# Altium schematic sheet Voltage_Regulator.SchDoc
size A3; SheetNumber: 3; SheetTotal: 4
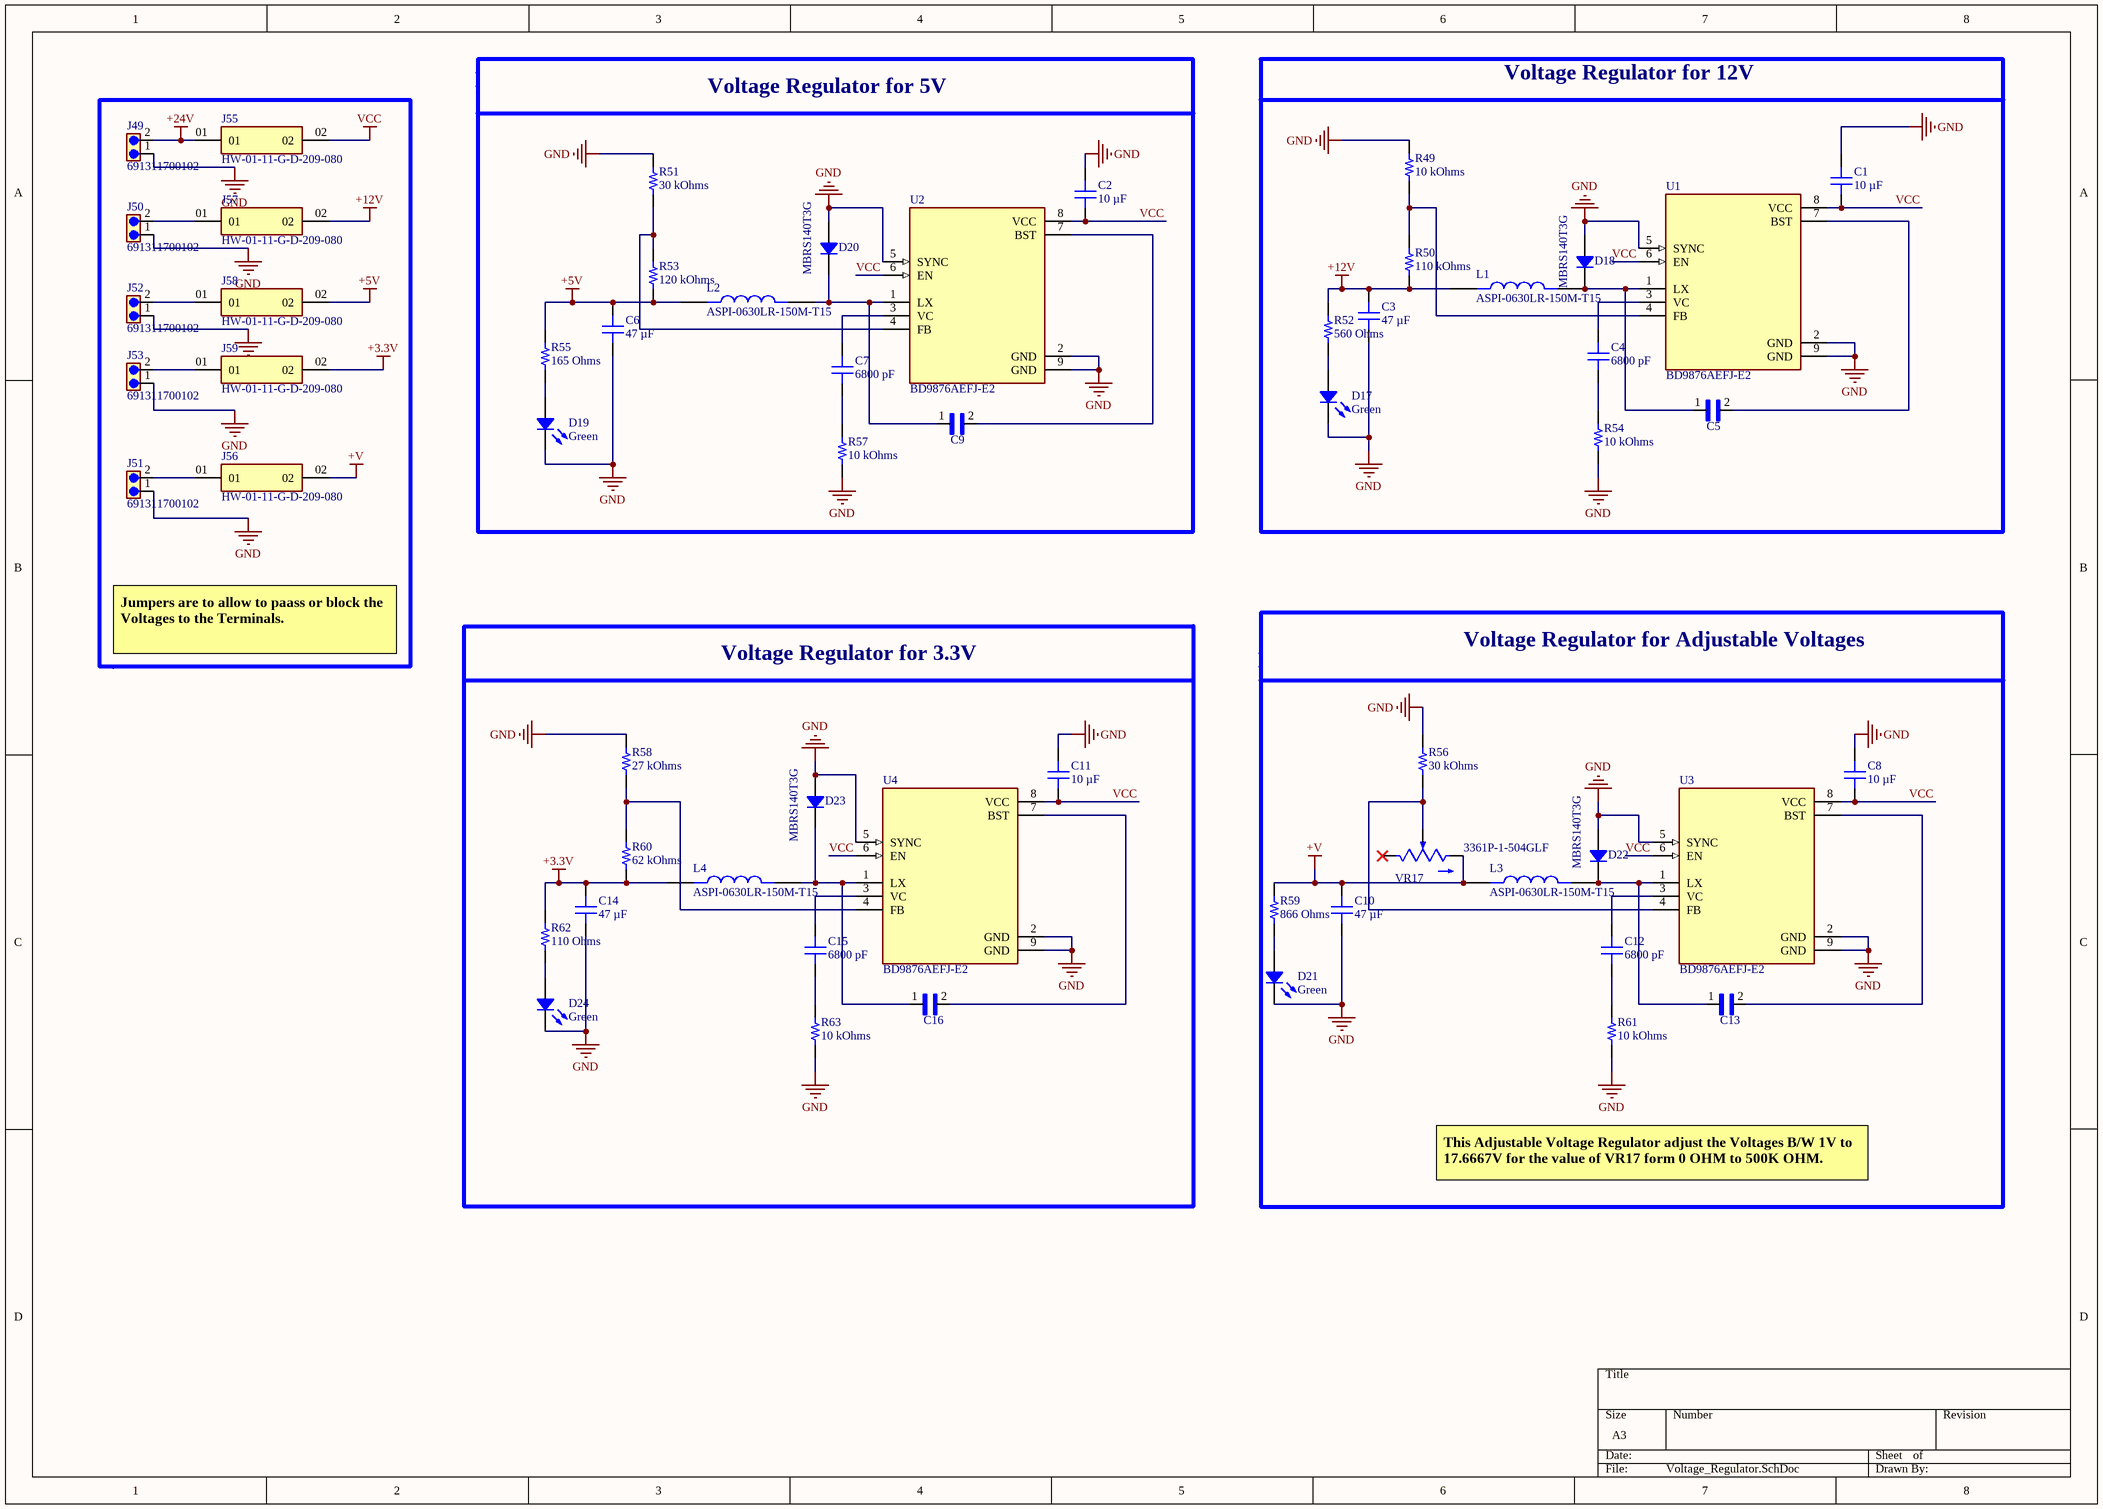
[diagram p0: Voltage_Regulator.SchDoc]

## Parts
C1  10 µF  [CAP 0603_1608]
C2  10 µF  [CAP 0603_1608]
C3  47 µF  [CAP 0603_1608]
C4  6800 pF  [CAP 0603_1608]
C5  C0603C103J5REC7411  [CAPC1608X87N]  (value not drawn)
C6  47 µF  [CAP 0603_1608]
C7  6800 pF  [CAP 0603_1608]
C8  10 µF  [CAP 0603_1608]
C9  C0603C103J5REC7411  [CAPC1608X87N]  (value not drawn)
C10  47 µF  [CAP 0603_1608]
C11  10 µF  [CAP 0603_1608]
C12  6800 pF  [CAP 0603_1608]
C13  C0603C103J5REC7411  [CAPC1608X87N]  (value not drawn)
C14  47 µF  [CAP 0603_1608]
C15  6800 pF  [CAP 0603_1608]
C16  C0603C103J5REC7411  [CAPC1608X87N]  (value not drawn)
D17  Green  [LED 0805_2012 GREEN]
D18  MBRS140T3G  [DO214AA SMB]
D19  Green  [LED 0805_2012 GREEN]
D20  MBRS140T3G  [DO214AA SMB]
D21  Green  [LED 0805_2012 GREEN]
D22  MBRS140T3G  [DO214AA SMB]
D23  MBRS140T3G  [DO214AA SMB]
D24  Green  [LED 0805_2012 GREEN]
J49  691311700102  [691311700102]
J50  691311700102  [691311700102]
J51  691311700102  [691311700102]
J52  691311700102  [691311700102]
J53  691311700102  [691311700102]
J55  HW-01-11-G-D-209-080  [SAMTEC_HW-01-11-G-D-209-080]
J56  HW-01-11-G-D-209-080  [SAMTEC_HW-01-11-G-D-209-080]
J57  HW-01-11-G-D-209-080  [SAMTEC_HW-01-11-G-D-209-080]
J58  HW-01-11-G-D-209-080  [SAMTEC_HW-01-11-G-D-209-080]
J59  HW-01-11-G-D-209-080  [SAMTEC_HW-01-11-G-D-209-080]
L1  ASPI-0630LR-150M-T15  [IND_ASPI-0630LR-150M-T15]
L2  ASPI-0630LR-150M-T15  [IND_ASPI-0630LR-150M-T15]
L3  ASPI-0630LR-150M-T15  [IND_ASPI-0630LR-150M-T15]
L4  ASPI-0630LR-150M-T15  [IND_ASPI-0630LR-150M-T15]
R49  10 kOhms  [RES 0603_1608]
R50  110 kOhms  [RES 0603_1608]
R51  30 kOhms  [RES 0603_1608]
R52  560 Ohms  [RES 0603_1608]
R53  120 kOhms  [RES 0603_1608]
R54  10 kOhms  [RES 0603_1608]
R55  165 Ohms  [RES 0603_1608]
R56  30 kOhms  [RES 0603_1608]
R57  10 kOhms  [RES 0603_1608]
R58  27 kOhms  [RES 0603_1608]
R59  866 Ohms  [RES 0603_1608]
R60  62 kOhms  [RES 0603_1608]
R61  10 kOhms  [RES 0603_1608]
R62  110 Ohms  [RES 0603_1608]
R63  10 kOhms  [RES 0603_1608]
U1  BD9876AEFJ-E2  [SOIC127P600X100-9N]
U2  BD9876AEFJ-E2  [SOIC127P600X100-9N]
U3  BD9876AEFJ-E2  [SOIC127P600X100-9N]
U4  BD9876AEFJ-E2  [SOIC127P600X100-9N]
VR17  3361P-1-504GLF  [TRIM_3361P-1-504GLF]

## Blocks framed on the sheet
Voltage Regulator for 12V: C1 C3-C5 D17 D18 L1 R49 R50 R52 R54 U1
Voltage Regulator for 3.3V: C11 C14-C16 D23 D24 L4 R58 R60 R62 R63 U4

## Nets
+3.3V: C14.2 J59.02 L4.1 R60.2 R62.2
+5V: C6.2 J58.02 L2.1 R53.1 R55.2
+12V: C3.2 J57.02 L1.1 R50.1 R52.2
+24V: J49.2 J55.01
+V: C10.2 J56.02 L3.1 R59.2 VR17.3(CW)
GND: C1.2 C2.2 C3.1 C6.1 C8.2 C10.1 C11.2 C14.1 D17.2 D18.1 D19.2 D20.1 D21.2 D22.1 D23.1 D24.2 J49.1 J50.1 J51.1 J52.1 J53.1 R49.2 R51.2 R54.1 R56.2 R57.1 R58.2 R61.1 R63.1 U1.2(GND) U1.5(SYNC) U1.9(GND) U2.2(GND) U2.5(SYNC) U2.9(GND) U3.2(GND) U3.5(SYNC) U3.9(GND) U4.2(GND) U4.5(SYNC) U4.9(GND)
VCC: C1.1 C2.1 C8.1 C11.1 J55.02 U1.6(EN) U1.8(VCC) U2.6(EN) U2.8(VCC) U3.6(EN) U3.8(VCC) U4.6(EN) U4.8(VCC)
NetC4_1: C4.1 R54.2
NetC4_2: C4.2 U1.3(VC)
NetC5_1: C5.1 D18.2 L1.2 U1.1(LX)
NetC5_2: C5.2 U1.7(BST)
NetC7_1: C7.1 R57.2
NetC7_2: C7.2 U2.3(VC)
NetC9_1: C9.1 D20.2 L2.2 U2.1(LX)
NetC9_2: C9.2 U2.7(BST)
NetC12_1: C12.1 R61.2
NetC12_2: C12.2 U3.3(VC)
NetC13_1: C13.1 D22.2 L3.2 U3.1(LX)
NetC13_2: C13.2 U3.7(BST)
NetC15_1: C15.1 R63.2
NetC15_2: C15.2 U4.3(VC)
NetC16_1: C16.1 D23.2 L4.2 U4.1(LX)
NetC16_2: C16.2 U4.7(BST)
NetD17_1: D17.1 R52.1
NetD19_1: D19.1 R55.1
NetD21_1: D21.1 R59.1
NetD24_1: D24.1 R62.1
NetJ50_2: J50.2 J57.01
NetJ51_2: J51.2 J56.01
NetJ52_2: J52.2 J58.01
NetJ53_2: J53.2 J59.01
NetR49_1: R49.1 R50.2 U1.4(FB)
NetR51_1: R51.1 R53.2 U2.4(FB)
NetR56_1: R56.1 U3.4(FB) VR17.2(WIPER)
NetR58_1: R58.1 R60.1 U4.4(FB)

Not connected (* = marked no-connect by the designer): VR17 1(CCW)*

## Notes on the sheet
- Voltage Regulator for 5V
- Jumpers are to allow to paass or block the Voltages to the Terminals.
- Voltage Regulator for Adjustable Voltages
- This Adjustable Voltage Regulator adjust the Voltages B/W 1V to 17.6667V for the value of VR17 form 0 OHM to 500K OHM.

## Library data of the parts
C1 C2 C8 C11 = 0603DD106MAT2A: CAP CER 10UF 35V X5R 0603; manufacturer: KYOCERA AVX; Tolerance: ±20%; Part Number: 0603DD106MAT2A; Value: 10 µF; Applications: General Purpose; Capacitance: 10 µF; componentlink2description: DigiKey Link; componentlink2url: https://www.digikey.com/en/products/detail/kyocera-avx/0603DD106MAT2A/16602926; Device Package: 0603 (1608 Metric); lastupdated: 08/03/2023 8:07:23 pm; Lifecycle Status: Active; Minimum Order: 1; Mounting Type: Surface Mount, MLCC; Operating Temperature: -55°C ~ 85°C; Package / Case: 0603 (1608 Metric); packaging: TapeAndReel; partid: 46895; Part Status: Active; price: 0.05; series: -; Size / Dimension: 0.063" L x 0.031" W (1.60mm x 0.80mm); Supplier 1: DigiKey; Supplier Part Number 1: 478-0603DD106MAT2ACT-ND; Temperature Coefficient: X5R; Voltage - Rated: 35V
C3 C6 C10 C14 = GRM188R60J476ME15D: CAP CER 47UF 6.3V X5R 0603; manufacturer: Murata Electronics; Tolerance: ±20%; Part Number: GRM188R60J476ME15D; Value: 47 µF; Applications: General Purpose; Capacitance: 47 µF; componentlink1description: Datasheet; componentlink1url: https://www.murata.com/~/media/webrenewal/support/library/catalog/products/capacitor/mlcc/c02e.ashx?la=en-us; componentlink2description: DigiKey Link; componentlink2url: https://www.digikey.com/en/products/detail/murata-electronics/GRM188R60J476ME15D/5877410; Device Package: 0603 (1608 Metric); lastupdated: 08/03/2023 8:08:50 pm; Lifecycle Status: Active; Minimum Order: 1; Mounting Type: Surface Mount, MLCC; Operating Temperature: -55°C ~ 85°C; Package / Case: 0603 (1608 Metric); packaging: TapeAndReel; partid: 5468; Part Status: Active; price: 0.10; series: GRM; Size / Dimension: 0.063" L x 0.031" W (1.60mm x 0.80mm); Supplier 1: DigiKey; Supplier Part Number 1: 490-13247-1-ND; Temperature Coefficient: X5R; Thickness (Max): 0.039" (1.00mm); Voltage - Rated: 6.3V
C4 C7 C12 C15 = EMK107SD682JA-T: CAP CER 6800PF 16V 0603; manufacturer: Taiyo Yuden; Tolerance: ±5%; Part Number: EMK107SD682JA-T; Value: 6800 pF; Applications: General Purpose; Capacitance: 6800 pF; componentlink1description: Datasheet; componentlink1url: http://www.yuden.co.jp/productdata/catalog/mlcc07_e.pdf; componentlink2description: DigiKey Link; componentlink2url: https://www.digikey.com/en/products/detail/taiyo-yuden/EMK107SD682JA-T/930441; Device Package: 0603 (1608 Metric); Features: Low Distortion; lastupdated: 08/03/2023 8:08:44 pm; Lifecycle Status: Active; Minimum Order: 1; Mounting Type: Surface Mount, MLCC; Operating Temperature: -55°C ~ 125°C; Package / Case: 0603 (1608 Metric); packaging: TapeAndReel; partid: 7463; Part Status: Active; price: 0.07; series: CFCAP™; Size / Dimension: 0.063" L x 0.031" W (1.60mm x 0.80mm); Supplier 1: DigiKey; Supplier Part Number 1: 587-1089-1-ND; Thickness (Max): 0.035" (0.90mm); Voltage - Rated: 16V
C5 C9 C13 C16 = C0603C103J5REC7411: 10000pF Â±5% 50V Ceramic Capacitor X7R 0603 (1608 Metric); MF: KEMET; DigiKey-Purchase-URL: https://snapeda.com/shop?store=DigiKey&id=2066766; MP: C0603C103J5REC7411; Availability: Unavailable; Package: 1608 KEMET; Value: *; Price: None; SnapEDA_Link: https://www.snapeda.com/parts/C0603C103J5REC7411/KEMET/view-part/2066766/?ref=snap
D17 D19 D21 D24 = QTLP630C4TR: LED GREEN CLEAR 0805 SMD; Manufacturer: Everlight Electronics Co Ltd; Configuration: Standard; Current - Test: 20mA; Lens Color: Colorless; Lens Size: 1.40mm x 1.25mm; Lens Style: Rectangle with Flat Top; Millicandela Rating: 10mcd; Viewing Angle: 140°; Voltage - Forward (Vf) (Typ): 2.1V; Wavelength - Dominant: 570nm; Wavelength - Peak: 565nm; Part Number: QTLP630C4TR; Color: Green; ComponentLink1Description: Datasheet; ComponentLink1URL: //media.digikey.com/PDF/Data%20Sheets/Everlight%20PDFs/QTLP630-2.pdf; ComponentLink2Description: DigiKey Link; ComponentLink2URL: https://www.digikey.com/en/products/detail/everlight-electronics-co-ltd/QTLP630C4TR/2675902; Device Package: 0805 (2012 Metric); Height (Max): 1.20mm; LastUpdated: 08/03/2023 8:58:32 pm; Lens Transparency: Clear; Lifecycle Status: Active; Minimum Order: 1; Mounting Type: Surface Mount; Package / Case: 0805 (2012 Metric); Packaging: TapeAndReel; PartId: 240; Part Status: Active; Price: 0.04; Series: -; Size / Dimension: 2.00mm L x 1.25mm W; Supplier 1: DigiKey; Supplier Part Number 1: 1080-1411-1-ND; Supplier Device Package: 0805; Value: Green
D18 D20 D22 D23 = MBRS140T3G: DIODE SCHOTTKY 40V 1A SMB; Manufacturer: ON Semiconductor; Current - Reverse Leakage @ Vr: 1mA @ 40V; Speed: Fast Recovery =< 500ns, > 200mA (Io); Voltage - Forward (Vf) (Max) @ If: 600mV @ 1A; Part Number: MBRS140T3G; ComponentLink1Description: Datasheet; ComponentLink1URL: https://www.onsemi.com/pub/Collateral/MBRS140T3-D.PDF; ComponentLink2Description: DigiKey Link; ComponentLink2URL: http://digikey.com/product-detail/en/on-semiconductor/MBRS140T3G/MBRS140T3GOSCT-ND/918002; Current - Average Rectified (Io): 1A; Diode Type: Schottky; LastUpdated: 08/03/2023 8:53:35 pm; Lifecycle Status: Active; Minimum Order: 1; Mounting Type: Surface Mount; Operating Temperature - Junction: -65°C ~ 125°C; Package / Case: DO-214AA, SMB; Packaging: TapeAndReel; PartId: 1387; Part Status: Active; Price: 0.08; Series: -; Supplier 1: DigiKey; Supplier Part Number 1: MBRS140T3GOSCT-ND; Supplier Device Package: SMB; Voltage - DC Reverse (Vr) (Max): 40V
J49-J53 = 691311700102: 2 Position Terminal Block Header, Male Pins, Shrouded (4 Side) 0.197 (5.00mm) Vertical - Through Hole; MF: WÃ¼rth Elektronik; Value: *; Check_prices: https://www.snapeda.com/parts/691311700102/Wurth+Elektronik/view-part/?ref=eda; Availability: In Stock; Package: None; SnapEDA_Link: https://www.snapeda.com/parts/691311700102/Wurth+Elektronik/view-part/?ref=snap; Purchase-URL: https://pricing.snapeda.com/search/part/691311700102/?ref=eda; Price: None; MP: 691311700102
J55-J59 = HW-01-11-G-D-209-080: CONN HDR 2POS STACK T/H; MF: Samtec; Purchase-URL: https://pricing.snapeda.com/search/part/HW-01-11-G-D-209-080/?ref=eda; Value: *; Package: None; Check_prices: https://www.snapeda.com/parts/HW-01-11-G-D-209-080/Samtec/view-part/?ref=eda; Price: None; MP: HW-01-11-G-D-209-080; Availability: In Stock; SnapEDA_Link: https://www.snapeda.com/parts/HW-01-11-G-D-209-080/Samtec/view-part/?ref=snap
L1-L4 = ASPI-0630LR-150M-T15: 15 ÂµH Shielded Molded Inductor 3 A 120mOhm Max Nonstandard; MF: Abracon LLC; Check_prices: https://www.snapeda.com/parts/ASPI-0630LR-150M-T15/Abracon+LLC/view-part/?ref=eda; Digi-Key_Part_Number: ASPI-0630LR-150M-T15TR-ND; Value: *; SnapEDA_Link: https://www.snapeda.com/parts/ASPI-0630LR-150M-T15/Abracon+LLC/view-part/?ref=snap; Package: Nonstandard Abracon LLC; MP: ASPI-0630LR-150M-T15; Purchase-URL: https://pricing.snapeda.com/search/part/ASPI-0630LR-150M-T15/?ref=eda
R49 = RT0603FRE0710KL: RES SMD 10K OHM 1% 1/10W 0603; Manufacturer: Yageo; Power (Watts): 0.1W, 1/10W; Temperature Coefficient: ±50ppm/°C; Part Number: RT0603FRE0710KL; Value: 10 kOhms; ComponentLink1Description: Datasheet; ComponentLink1URL: https://www.yageo.com/upload/media/product/productsearch/datasheet/rchip/PYu-RT_1-to-0.01_RoHS_L_11.pdf; ComponentLink2Description: DigiKey Link; ComponentLink2URL: https://www.digikey.com/en/products/detail/yageo/RT0603FRE0710KL/1075040; Composition: Thin Film; Device Package: 0603 (1608 Metric); Height - Seated (Max): 0.022" (0.55mm); LastUpdated: 08/03/2023 8:30:15 pm; Lifecycle Status: Active; Minimum Order: 1; Number of Terminations: 2; Operating Temperature: -55°C ~ 155°C; Package / Case: 0603 (1608 Metric); Packaging: TapeAndReel; PartId: 5671; Part Status: Active; Price: 0.01; Resistance: 10 kOhms; Series: RT; Size / Dimension: 0.063" L x 0.031" W (1.60mm x 0.80mm); Supplier 1: DigiKey; Supplier Part Number 1: YAG2321CT-ND; Supplier Device Package: 0603; Tolerance: ±1%
R50 = CRCW0603110KFKEA: RES SMD 110K OHM 1% 1/10W 0603; Manufacturer: Vishay Dale; Power (Watts): 0.1W, 1/10W; Temperature Coefficient: ±100ppm/°C; Part Number: CRCW0603110KFKEA; Value: 110 kOhms; ComponentLink1Description: Datasheet; ComponentLink1URL: http://www.vishay.com/docs/20035/dcrcwe3.pdf; ComponentLink2Description: DigiKey Link; ComponentLink2URL: http://digikey.com/product-detail/en/vishay-dale/CRCW0603110KFKEA/541-110KHCT-ND/1180042; Composition: Thick Film; Device Package: 0603 (1608 Metric); Features: Automotive AEC-Q200; Height - Seated (Max): 0.020" (0.50mm); LastUpdated: 08/03/2023 8:30:07 pm; Lifecycle Status: Active; Minimum Order: 1; Number of Terminations: 2; Operating Temperature: -55°C ~ 155°C; Package / Case: 0603 (1608 Metric); Packaging: CutTape; PartId: 7799; Part Status: Active; Price: 0.10; Ratings: AEC-Q200; Resistance: 110 kOhms; Series: CRCW; Size / Dimension: 0.061" L x 0.033" W (1.55mm x 0.85mm); Supplier 1: DigiKey; Supplier Part Number 1: 541-110KHCT-ND; Supplier Device Package: 0603; Tolerance: ±1%
R51 R56 = RMCF0603FT30K0: RES 30K OHM 1% 1/10W 0603; Manufacturer: Stackpole Electronics Inc; Power (Watts): 0.1W, 1/10W; Temperature Coefficient: ±100ppm/°C; Part Number: RMCF0603FT30K0; Value: 30 kOhms; ComponentLink1Description: Datasheet; ComponentLink1URL: https://www.seielect.com/catalog/sei-rmcf_rmcp.pdf; ComponentLink2Description: DigiKey Link; ComponentLink2URL: https://www.digikey.com/en/products/detail/stackpole-electronics-inc/RMCF0603FT30K0/1760793; Composition: Thick Film; Device Package: 0603 (1608 Metric); Features: Automotive AEC-Q200; Height - Seated (Max): 0.022" (0.55mm); LastUpdated: 08/03/2023 8:29:57 pm; Lifecycle Status: Active; Minimum Order: 1; Number of Terminations: 2; Operating Temperature: -55°C ~ 155°C; Package / Case: 0603 (1608 Metric); Packaging: CutTape; PartId: 10655; Part Status: Active; Price: 0.01; Ratings: AEC-Q200; Resistance: 30 kOhms; Series: RMCF; Size / Dimension: 0.061" L x 0.031" W (1.55mm x 0.80mm); Supplier 1: DigiKey; Supplier Part Number 1: RMCF0603FT30K0CT-ND; Supplier Device Package: 0603; Tolerance: ±1%
R52 = MCT06030C5600FP500: RES SMD 560 OHM 1% 1/8W 0603; Manufacturer: Vishay Beyschlag; Power (Watts): 0.125W, 1/8W; Temperature Coefficient: ±50ppm/°C; Part Number: MCT06030C5600FP500; Value: 560 Ohms; ComponentLink1Description: Datasheet; ComponentLink1URL: http://www.vishay.com/docs/28705/mcx0x0xpro.pdf; ComponentLink2Description: DigiKey Link; ComponentLink2URL: http://digikey.com/product-detail/en/vishay-beyschlag/MCT06030C5600FP500/MCT0603-560-CFCT-ND/2607914; Composition: Thin Film; Device Package: 0603 (1608 Metric); Features: Anti-Sulfur; Height - Seated (Max): 0.022" (0.55mm); LastUpdated: 14/03/2023 7:28:48 pm; Lifecycle Status: Active; Minimum Order: 1; Number of Terminations: 2; Operating Temperature: -55°C ~ 155°C; Package / Case: 0603 (1608 Metric); Packaging: TapeAndReel; PartId: 14498; Part Status: Active; Price: 0.02; Resistance: 560 Ohms; Series: MCT - Professional; Size / Dimension: 0.061" L x 0.033" W (1.55mm x 0.85mm); Supplier 1: DigiKey; Supplier Part Number 1: MCT0603-560-CFCT-ND; Supplier Device Package: 0603; Tolerance: ±1%
R53 = CRGP0603F120K: RES 120K OHM 1% 1/4W 0603; Manufacturer: TE Connectivity Passive Product; Power (Watts): 0.25W, 1/4W; Temperature Coefficient: ±100ppm/°C; Part Number: CRGP0603F120K; Value: 120 kOhms; ComponentLink1Description: Datasheet; ComponentLink1URL: https://www.te.com/commerce/DocumentDelivery/DDEController?Action=srchrtrv&DocNm=9-1773463-9&DocType=DS&DocLang=English; ComponentLink2Description: DigiKey Link; ComponentLink2URL: https://www.digikey.com/en/products/detail/te-connectivity-passive-product/CRGP0603F120K/8577043; Composition: Thick Film; Device Package: 0603 (1608 Metric); Features: Pulse Withstanding; Height - Seated (Max): 0.022" (0.55mm); LastUpdated: 08/03/2023 8:30:17 pm; Lifecycle Status: Active; Minimum Order: 1; Number of Terminations: 2; Operating Temperature: -55°C ~ 155°C; Package / Case: 0603 (1608 Metric); Packaging: TapeAndReel; PartId: 5040; Part Status: Active; Price: 0.02; Resistance: 120 kOhms; Series: CRGP; Size / Dimension: 0.063" L x 0.031" W (1.60mm x 0.80mm); Supplier 1: DigiKey; Supplier Part Number 1: A130441CT-ND; Supplier Device Package: 0603; Tolerance: ±1%
R54 R57 R61 R63 = RNCS0603BKE10K0: RES 10K OHM 0.1% 1/16W 0603; Manufacturer: Stackpole Electronics Inc; Power (Watts): 0.063W, 1/16W; Temperature Coefficient: ±25ppm/°C; Part Number: RNCS0603BKE10K0; Value: 10 kOhms; ComponentLink1Description: Datasheet; ComponentLink1URL: https://www.seielect.com/catalog/sei-rncs_rnch.pdf; ComponentLink2Description: DigiKey Link; ComponentLink2URL: https://www.digikey.com/en/products/detail/stackpole-electronics-inc/RNCS0603BKE10K0/1708836; Composition: Thin Film; Device Package: 0603 (1608 Metric); Features: Anti-Corrosive, Automotive AEC-Q200, Moisture Resistant; Height - Seated (Max): 0.022" (0.55mm); LastUpdated: 08/03/2023 8:30:18 pm; Lifecycle Status: Active; Minimum Order: 1; Number of Terminations: 2; Operating Temperature: -55°C ~ 155°C; Package / Case: 0603 (1608 Metric); Packaging: TapeAndReel; PartId: 4838; Part Status: Active; Price: 0.07; Ratings: AEC-Q200; Resistance: 10 kOhms; Series: RNCS; Size / Dimension: 0.061" L x 0.031" W (1.55mm x 0.80mm); Supplier 1: DigiKey; Supplier Part Number 1: RNCS0603BKE10K0CT-ND; Supplier Device Package: 0603; Tolerance: ±0.1%
R55 = RK73H1JTTD1650F: RES 165 OHM 1% 1/8W 0603; Manufacturer: KOA Speer Electronics, Inc.; Power (Watts): 0.125W, 1/8W; Temperature Coefficient: ±100ppm/°C; Part Number: RK73H1JTTD1650F; Value: 165 Ohms; ComponentLink1Description: Datasheet; ComponentLink1URL: http://www.koaspeer.com/catimages/Products/RK73H/RK73H.pdf; ComponentLink2Description: DigiKey Link; ComponentLink2URL: https://www.digikey.com/en/products/detail/koa-speer-electronics-inc/RK73H1JTTD1650F/9845302; Composition: Thick Film; Device Package: 0603 (1608 Metric); Features: Automotive AEC-Q200, Moisture Resistant; Height - Seated (Max): 0.022" (0.55mm); LastUpdated: 14/03/2023 7:29:07 pm; Lifecycle Status: Active; Minimum Order: 1; Number of Terminations: 2; Operating Temperature: -55°C ~ 155°C; Package / Case: 0603 (1608 Metric); Packaging: CutTape; PartId: 8816; Part Status: Active; Price: 0.01; Ratings: AEC-Q200; Resistance: 165 Ohms; Series: RK73H; Size / Dimension: 0.063" L x 0.031" W (1.60mm x 0.80mm); Supplier 1: DigiKey; Supplier Part Number 1: 2019-RK73H1JTTD1650FCT-ND; Supplier Device Package: 0603; Tolerance: ±1%
R58 = CRGP0603F27K: RES 27K OHM 1% 1/4W 0603; Manufacturer: TE Connectivity Passive Product; Power (Watts): 0.25W, 1/4W; Temperature Coefficient: ±100ppm/°C; Part Number: CRGP0603F27K; Value: 27 kOhms; ComponentLink1Description: Datasheet; ComponentLink1URL: https://www.te.com/commerce/DocumentDelivery/DDEController?Action=srchrtrv&DocNm=9-1773463-9&DocType=DS&DocLang=English; ComponentLink2Description: DigiKey Link; ComponentLink2URL: https://www.digikey.com/en/products/detail/te-connectivity-passive-product/CRGP0603F27K/8577035; Composition: Thick Film; Device Package: 0603 (1608 Metric); Features: Pulse Withstanding; Height - Seated (Max): 0.022" (0.55mm); LastUpdated: 08/03/2023 8:30:17 pm; Lifecycle Status: Active; Minimum Order: 1; Number of Terminations: 2; Operating Temperature: -55°C ~ 155°C; Package / Case: 0603 (1608 Metric); Packaging: TapeAndReel; PartId: 5007; Part Status: Active; Price: 0.02; Resistance: 27 kOhms; Series: CRGP; Size / Dimension: 0.063" L x 0.031" W (1.60mm x 0.80mm); Supplier 1: DigiKey; Supplier Part Number 1: A130433CT-ND; Supplier Device Package: 0603; Tolerance: ±1%
R59 = RQ73C1J866RBTD: RES 866 OHMS 0.1% 0.15W 0603; Manufacturer: TE Connectivity Passive Product; Temperature Coefficient: ±10ppm/°C; Part Number: RQ73C1J866RBTD; Value: 866 Ohms; ComponentLink1Description: Datasheet; ComponentLink1URL: //media.digikey.com/pdf/Data%20Sheets/Tyco%20Electronics%20P%20B%20PDFs/RQ73-0618%20v2.pdf; ComponentLink2Description: DigiKey Link; ComponentLink2URL: https://www.digikey.com/en/products/detail/te-connectivity-passive-product/RQ73C1J866RBTD/9479913; Composition: Thin Film; Device Package: 0603 (1608 Metric); Features: Anti-Sulfur, Automotive AEC-Q200; Height - Seated (Max): 0.024" (0.60mm); LastUpdated: 14/03/2023 7:29:08 pm; Lifecycle Status: Active; Minimum Order: 1; Number of Terminations: 2; Operating Temperature: -55°C ~ 155°C; Package / Case: 0603 (1608 Metric); Packaging: TapeAndReel; PartId: 8503; Part Status: Active; Power (Watts): 0.15W; Price: 0.26; Ratings: AEC-Q200; Resistance: 866 Ohms; Series: RQ73; Size / Dimension: 0.061" L x 0.031" W (1.55mm x 0.80mm); Supplier 1: DigiKey; Supplier Part Number 1: A139965CT-ND; Supplier Device Package: 0603; Tolerance: ±0.1%
R60 = RMCF0603FT62K0: RES 62K OHM 1% 1/10W 0603; Manufacturer: Stackpole Electronics Inc; Power (Watts): 0.1W, 1/10W; Temperature Coefficient: ±100ppm/°C; Part Number: RMCF0603FT62K0; Value: 62 kOhms; ComponentLink1Description: Datasheet; ComponentLink1URL: https://www.seielect.com/catalog/sei-rmcf_rmcp.pdf; ComponentLink2Description: DigiKey Link; ComponentLink2URL: https://www.digikey.com/en/products/detail/stackpole-electronics-inc/RMCF0603FT62K0/1714175; Composition: Thick Film; Device Package: 0603 (1608 Metric); Features: Automotive AEC-Q200; Height - Seated (Max): 0.022" (0.55mm); LastUpdated: 08/03/2023 8:29:57 pm; Lifecycle Status: Active; Minimum Order: 1; Number of Terminations: 2; Operating Temperature: -55°C ~ 155°C; Package / Case: 0603 (1608 Metric); Packaging: CutTape; PartId: 10723; Part Status: Active; Price: 0.01; Ratings: AEC-Q200; Resistance: 62 kOhms; Series: RMCF; Size / Dimension: 0.061" L x 0.031" W (1.55mm x 0.80mm); Supplier 1: DigiKey; Supplier Part Number 1: RMCF0603FT62K0CT-ND; Supplier Device Package: 0603; Tolerance: ±1%
R62 = MCT06030C1100FP500: RES 110 OHM 1% 1/8W 0603; Manufacturer: Vishay Beyschlag; Power (Watts): 0.125W, 1/8W; Temperature Coefficient: ±50ppm/°C; Part Number: MCT06030C1100FP500; Value: 110 Ohms; ComponentLink1Description: Datasheet; ComponentLink1URL: http://www.vishay.com/docs/28705/mcx0x0xpro.pdf; ComponentLink2Description: DigiKey Link; ComponentLink2URL: http://digikey.com/product-detail/en/vishay-beyschlag/MCT06030C1100FP500/749-MCT06030C1100FP500CT-ND/10453856; Composition: Thin Film; Device Package: 0603 (1608 Metric); Features: Anti-Sulfur; Height - Seated (Max): 0.022" (0.55mm); LastUpdated: 14/03/2023 7:29:21 pm; Lifecycle Status: Active; Minimum Order: 1; Number of Terminations: 2; Operating Temperature: -55°C ~ 155°C; Package / Case: 0603 (1608 Metric); Packaging: TapeAndReel; PartId: 5092; Part Status: Active; Price: 0.02; Resistance: 110 Ohms; Series: MCT - Professional; Size / Dimension: 0.061" L x 0.033" W (1.55mm x 0.85mm); Supplier 1: DigiKey; Supplier Part Number 1: 749-MCT06030C1100FP500CT-ND; Supplier Device Package: 0603; Tolerance: ±1%
U1-U4 = BD9876AEFJ-E2: Buck Switching Regulator IC Positive Adjustable 1V 1 Output 3A 8-SOIC (0.154, 3.90mm Width) Exposed Pad; MF: Rohm; Availability: Bad; Package: SOIC-8 Rohm; Price: None; SnapEDA_Link: https://www.snapeda.com/parts/BD9876AEFJ-E2/Rohm/view-part/78992/?ref=snap; Value: *; MP: BD9876AEFJ-E2
VR17 = 3361P-1-504GLF: 500 kOhms 0.5W, 1/2W Gull Wing Surface Mount Trimmer Potentiometer Cermet 1.0 Turn Top Adjustment; MF: Bourns; Check_prices: https://www.snapeda.com/parts/3361P-1-504GLF/Bourns/view-part/?ref=eda; Digi-Key_Part_Number: 3361P-1-504GLFTR-ND; Package: 3361P Bourns; Value: *; MP: 3361P-1-504GLF; Purchase-URL: https://pricing.snapeda.com/search/part/3361P-1-504GLF/?ref=eda; SnapEDA_Link: https://www.snapeda.com/parts/3361P-1-504GLF/Bourns/view-part/?ref=snap